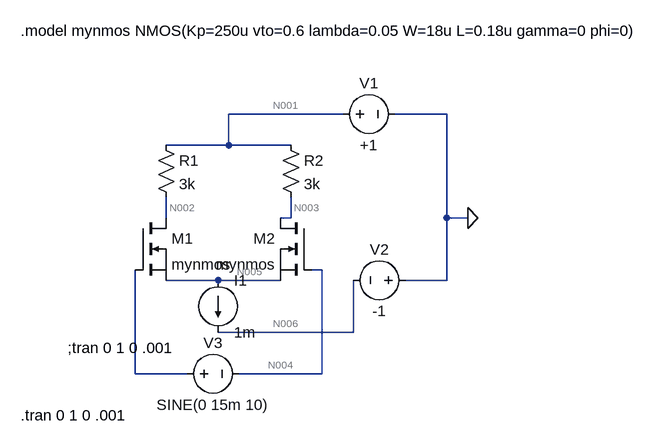
[diagram p0: schematic 1.asc]
1.asc, the LTspice schematic file:
Version 4
SHEET 1 936 680
WIRE 336 -96 160 -96
WIRE 496 -96 416 -96
WIRE 160 -48 160 -96
WIRE 160 -48 64 -48
WIRE 256 -48 160 -48
WIRE 64 64 64 32
WIRE 256 64 256 32
WIRE 256 64 240 64
WIRE 496 64 496 -96
WIRE 528 64 496 64
WIRE 304 144 288 144
WIRE 144 160 64 160
WIRE 240 160 144 160
WIRE 496 160 496 64
WIRE 496 160 432 160
WIRE 352 240 352 160
WIRE 352 240 144 240
WIRE 16 304 16 144
WIRE 96 304 16 304
WIRE 304 304 304 144
WIRE 304 304 176 304
FLAG 528 64 0
DATAFLAG 64 48 ""
DATAFLAG 256 48 ""
SYMBOL nmos 16 64 R0
SYMATTR InstName M1
SYMATTR Value mynmos
SYMBOL nmos 288 64 M0
SYMATTR InstName M2
SYMATTR Value mynmos
SYMBOL res 48 -64 R0
SYMATTR InstName R1
SYMATTR Value 3k
SYMBOL res 240 -64 R0
SYMATTR InstName R2
SYMATTR Value 3k
SYMBOL voltage 320 -96 R270
WINDOW 0 32 56 VTop 2
WINDOW 3 -32 56 VBottom 2
WINDOW 123 0 0 Left 0
WINDOW 39 0 0 Left 0
SYMATTR InstName V1
SYMATTR Value +1
SYMBOL voltage 448 160 R90
WINDOW 0 -32 56 VBottom 2
WINDOW 3 32 56 VTop 2
WINDOW 123 0 0 Left 0
WINDOW 39 0 0 Left 0
SYMATTR InstName V2
SYMATTR Value -1
SYMBOL current 144 160 R0
WINDOW 123 0 0 Left 0
WINDOW 39 0 0 Left 0
SYMATTR InstName I1
SYMATTR Value 1m
SYMBOL voltage 80 304 R270
WINDOW 0 32 56 VTop 2
WINDOW 3 -32 56 VBottom 2
WINDOW 123 0 0 Left 0
WINDOW 39 0 0 Left 0
SYMATTR InstName V3
SYMATTR Value SINE(0 15m 10)
TEXT -160 -224 Left 2 !.model mynmos NMOS(Kp=250u vto=0.6 lambda=0.05 W=18u L=0.18u gamma=0 phi=0)
TEXT -88 264 Left 2 !;tran 0 1 0 .001
TEXT -160 368 Left 2 !.tran 0 1 0 .001

The netlist it stands for:
* 1.asc
M1 N002 N007 N005 N005 mynmos
M2 N003 N004 N005 N005 mynmos
R1 N001 N002 3k
R2 N001 N003 3k
V1 N001 0 +1
V2 0 N006 -1
I1 N005 N006 1m
V3 N007 N004 SINE(0 15m 10)
.model NMOS NMOS
.model PMOS PMOS
.lib standard.mos
.model mynmos NMOS(Kp=250u vto=0.6 lambda=0.05 W=18u L=0.18u gamma=0 phi=0)
;tran 0 1 0 .001
.tran 0 1 0 .001
.backanno
.end

* Results of the author's LTspice run, read from the files saved beside the schematic
* Operating Point, zero values left out:
*   V(n002) = -500 mV
*   V(n005) = -798.5 mV
*   V(n003) = -500 mV
*   V(n001) = 1 V
*   V(n006) = 1 V
*   Id(M2) = 500 µA
*   Is(M2) = -500 µA
*   Id(M1) = 500 µA
*   Is(M1) = -500 µA
*   I(I1) = 1 mA
*   I(R2) = 500 µA
*   I(R1) = 500 µA
*   I(V2) = -1 mA
*   I(V1) = -1 mA
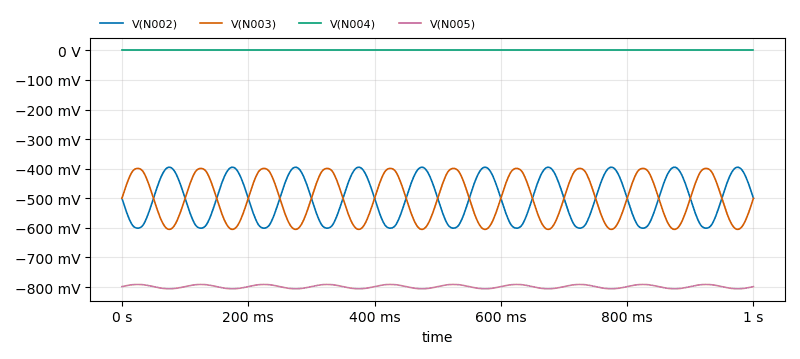
[diagram p1: Transient Analysis of 1.asc, plotted from the saved traces]
* Transient Analysis, 1 run:
*   V(N002): min -601 mV, max -395.2 mV, average -499.5 mV, rms 505 mV, last -500 mV
*   V(N003): min -604.8 mV, max -399 mV, average -500.5 mV, rms 505.9 mV, last -500 mV
*   V(N004): min -0.001735 fV, max 0.001735 fV, average -1.007e-05 fV, rms 0.0007297 fV, last 0 V
*   V(N005): min -805.9 mV, max -791.3 mV, average -798.5 mV, rms 798.5 mV, last -798.5 mV